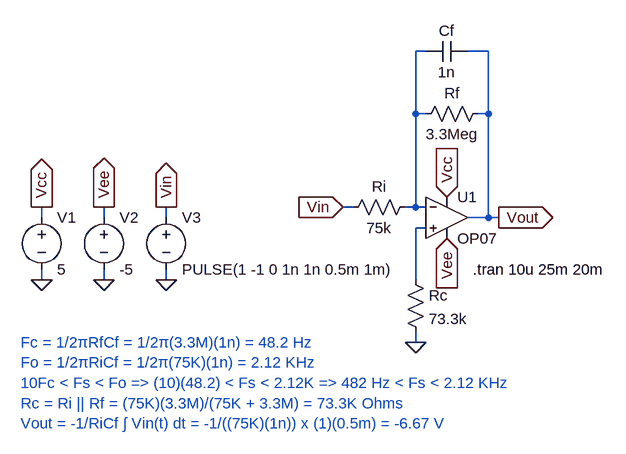
[diagram p0: schematic op-amp_integrating_amplifier.asc]
op-amp_integrating_amplifier.asc, the LTspice schematic file:
Version 4
SHEET 1 880 912
WIRE 416 64 400 64
WIRE 512 64 480 64
WIRE 400 160 400 64
WIRE 416 160 400 160
WIRE 512 160 512 64
WIRE 512 160 496 160
WIRE 304 304 288 304
WIRE 400 304 400 160
WIRE 400 304 384 304
WIRE 416 304 400 304
WIRE -176 320 -176 304
WIRE -80 320 -80 304
WIRE 16 320 16 304
WIRE 512 320 512 160
WIRE 512 320 480 320
WIRE 528 320 512 320
WIRE 416 336 400 336
WIRE -176 416 -176 400
WIRE -80 416 -80 400
WIRE 16 416 16 400
WIRE 400 416 400 336
WIRE 400 512 400 496
FLAG 448 288 Vcc
IOPIN 448 288 In
FLAG 448 352 Vee
IOPIN 448 352 In
FLAG 288 304 Vin
IOPIN 288 304 In
FLAG 528 320 Vout
IOPIN 528 320 Out
FLAG -176 416 0
FLAG -80 416 0
FLAG 16 416 0
FLAG -176 304 Vcc
IOPIN -176 304 Out
FLAG -80 304 Vee
IOPIN -80 304 Out
FLAG 16 304 Vin
IOPIN 16 304 Out
FLAG 400 512 0
SYMBOL OpAmps/OP07 448 256 R0
SYMATTR InstName U1
SYMBOL res 512 144 R90
WINDOW 0 0 56 VBottom 2
WINDOW 3 32 56 VTop 2
SYMATTR InstName Rf
SYMATTR Value 3.3Meg
SYMBOL voltage -176 304 R0
SYMATTR InstName V1
SYMATTR Value 5
SYMBOL voltage -80 304 R0
SYMATTR InstName V2
SYMATTR Value -5
SYMBOL voltage 16 304 R0
SYMATTR InstName V3
SYMATTR Value PULSE(1 -1 0 1n 1n 0.5m 1m)
SYMBOL res 400 288 R90
WINDOW 0 0 56 VBottom 2
WINDOW 3 32 56 VTop 2
SYMATTR InstName Ri
SYMATTR Value 75k
SYMBOL cap 480 48 R90
WINDOW 0 0 32 VBottom 2
WINDOW 3 32 32 VTop 2
SYMATTR InstName Cf
SYMATTR Value 1n
SYMBOL res 384 400 R0
SYMATTR InstName Rc
SYMATTR Value 73.3k
TEXT 488 400 Left 2 !.tran 10u 25m 20m
TEXT -208 512 Left 2 ;Fc = 1/2πRfCf = 1/2π(3.3M)(1n) = 48.2 Hz\nFo = 1/2πRiCf = 1/2π(75K)(1n) = 2.12 KHz\n10Fc < Fs < Fo => (10)(48.2) < Fs < 2.12K => 482 Hz < Fs < 2.12 KHz\nRc = Ri || Rf = (75K)(3.3M)/(75K + 3.3M) = 73.3K Ohms\nVout = -1/RiCf ∫ Vin(t) dt = -1/((75K)(1n)) x (1)(0.5m) = -6.67 V

The netlist it stands for:
* op-amp_integrating_amplifier.asc
XU1 N002 N001 Vcc Vee Vout LT1001  ; OP07, pins In+ In- V+ V- OUT
Rf Vout N001 3.3Meg
V1 Vcc 0 5
V2 Vee 0 -5
V3 Vin 0 PULSE(1 -1 0 1n 1n 0.5m 1m)
Ri N001 Vin 75k
Cf Vout N001 1n
Rc N002 0 73.3k
.tran 10u 25m 20m
* Fc = 1/2πRfCf = 1/2π(3.3M)(1n) = 48.2 Hz
* Fo = 1/2πRiCf = 1/2π(75K)(1n) = 2.12 KHz
* 10Fc < Fs < Fo => (10)(48.2) < Fs < 2.12K => 482 Hz < Fs < 2.12 KHz
* Rc = Ri || Rf = (75K)(3.3M)/(75K + 3.3M) = 73.3K Ohms
* Vout = -1/RiCf ∫ Vin(t) dt = -1/((75K)(1n)) x (1)(0.5m) = -6.67 V
.lib LTC.lib
.backanno
.end